# EasyEDA schematic Aquarium.Temperatur.json
TITLE: Aquarium.Temperatur; REV: 1.0; Date: 2019-01-31; Sheet: 1/1; Drawn By: Stefan Burkhardt; Company: Private
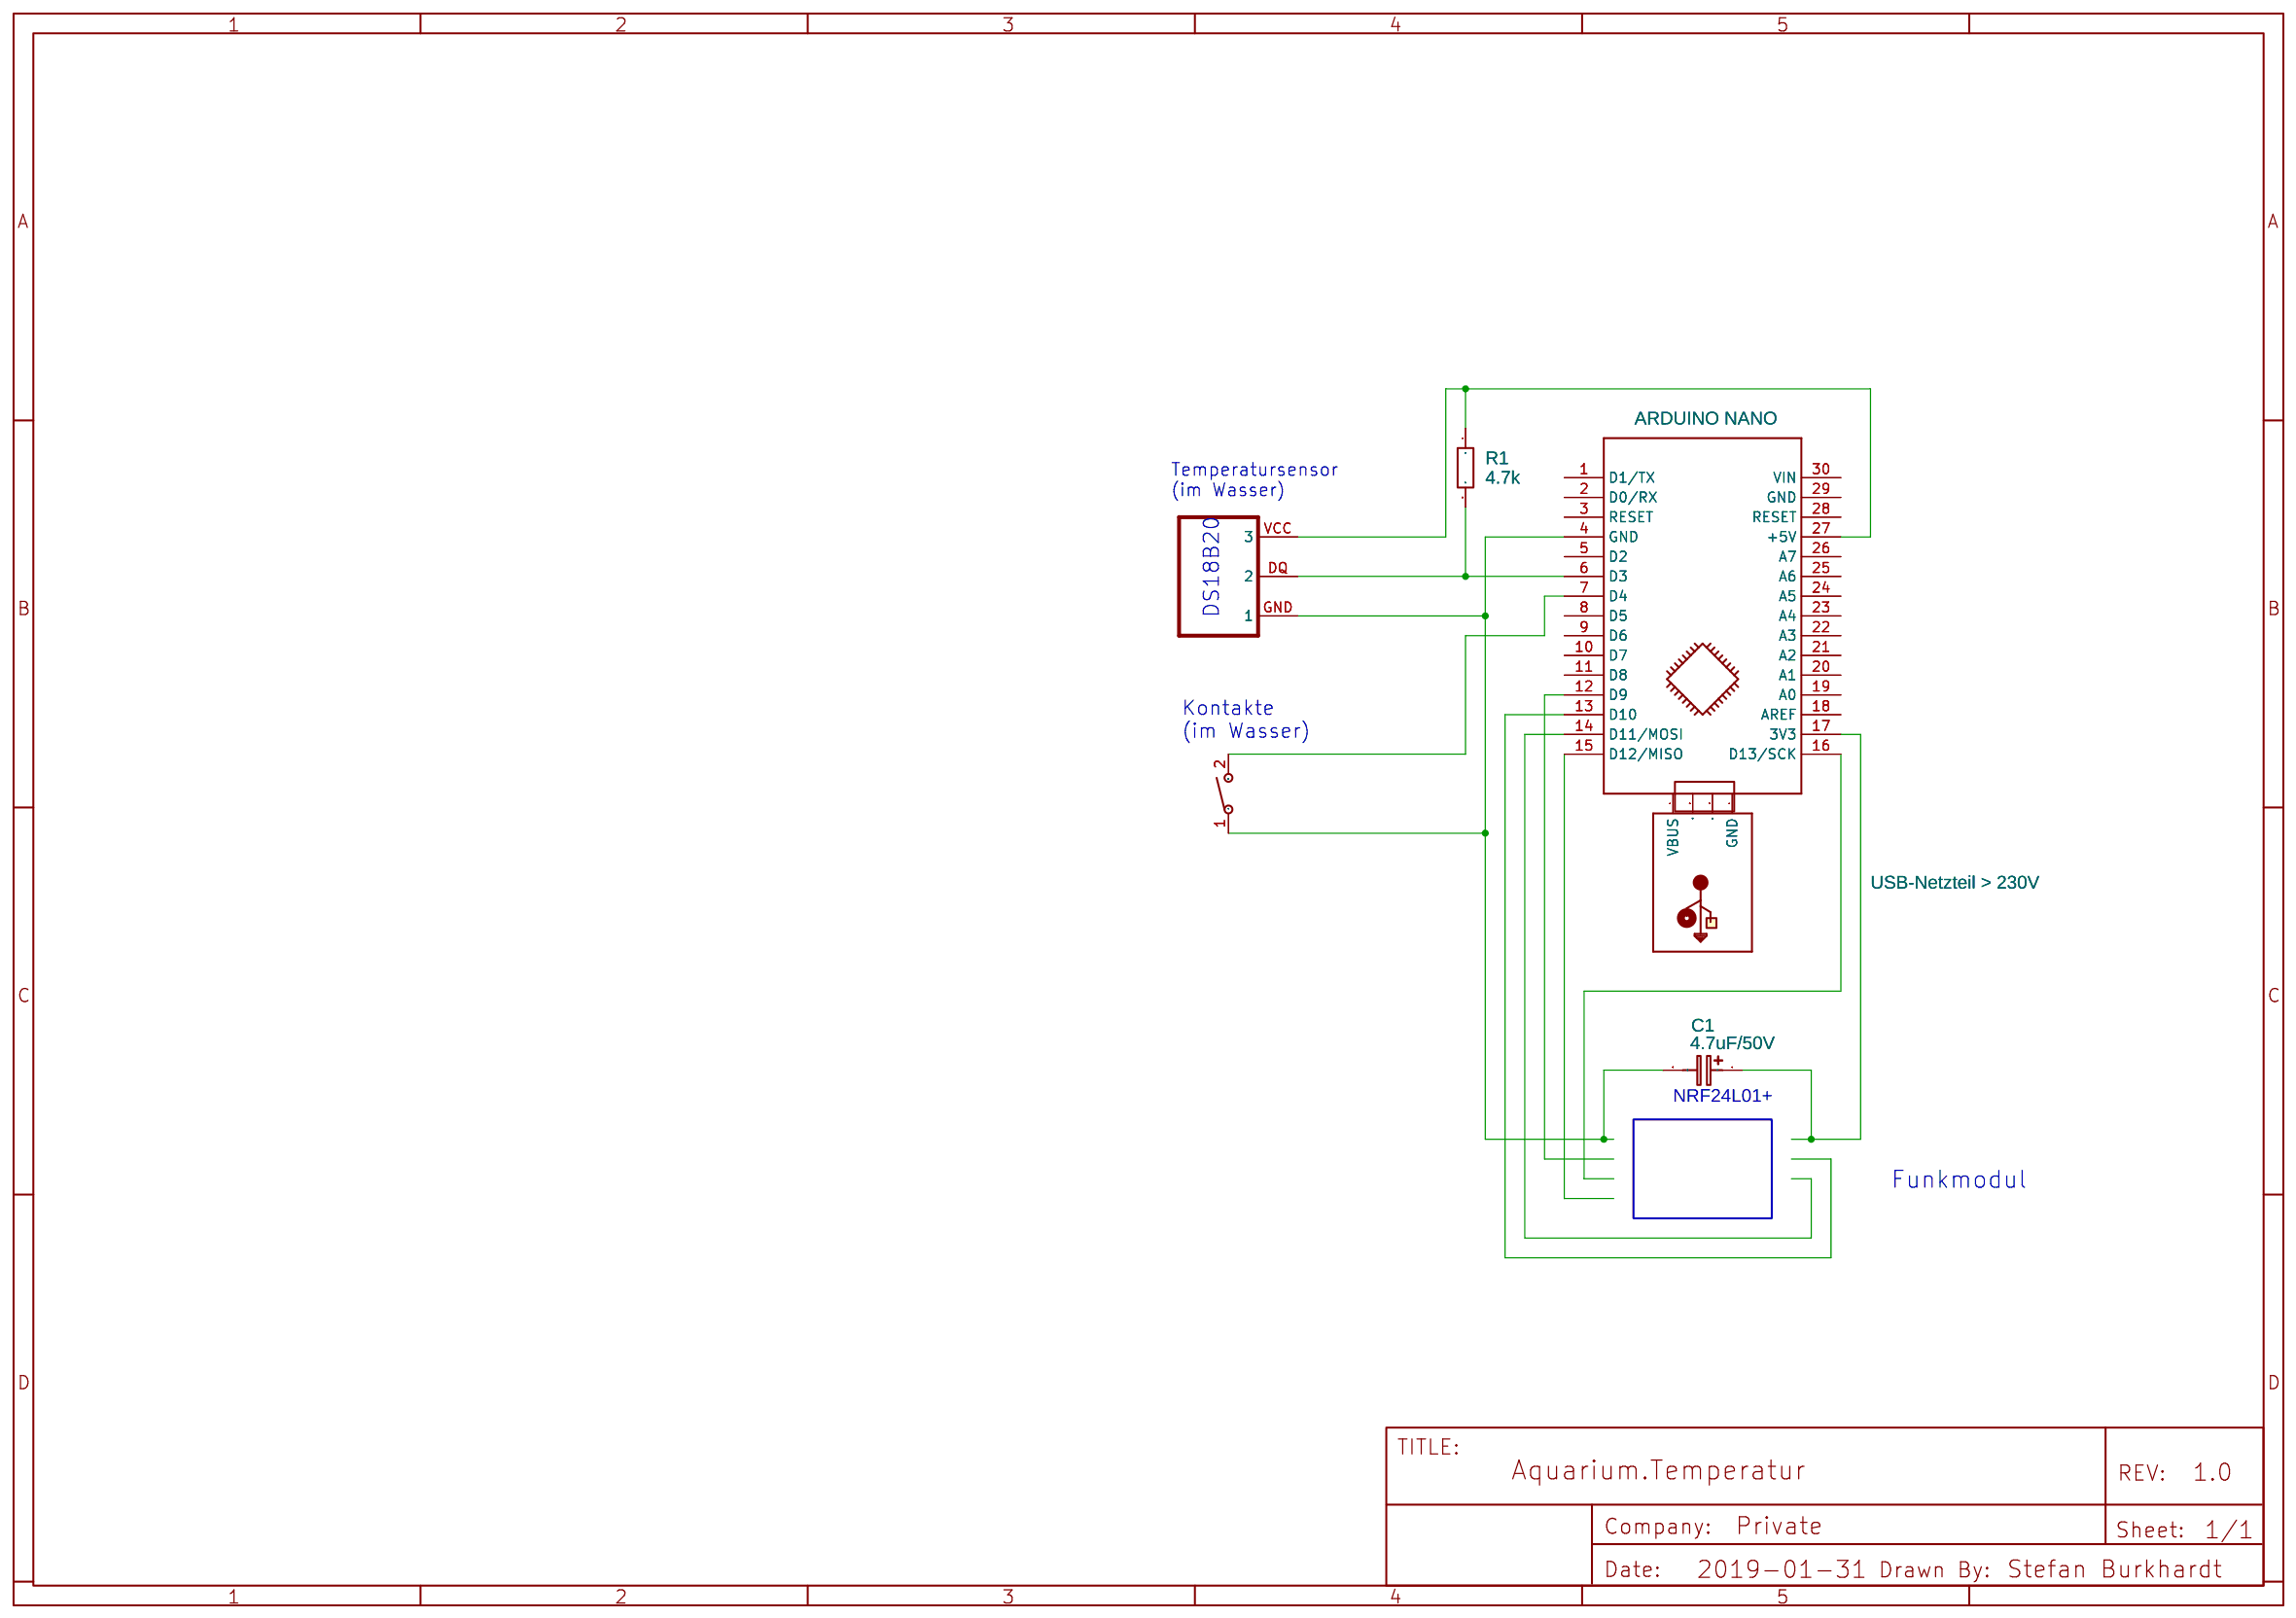
[diagram p0: schematic sheet]

## Parts
C1  4.7uF/50V  [CAP-D3.0XF1.5]
R1  4.7k  [AXIAL-0.3]
SW1  Wasser-Kurzschluss  [K2-1107ST-A4SW-06]
U1  ARDUINO NANO  [ARDUINO_NANO]
U2  DS18B20  [DIP]
X1  USB-Netzteil > 230V  [MOLEX_480371000]

## Library data of the parts
C1 = Cap_Electrolytic(TH)_D3.0XF1.5_EU: Contributor: EasyEDA; Manufacturer Part: ?
R1 = Res_AXIAL-0.3(1/8W)_EU: Manufacturer Part: ?
SW1 = -: Supplier: LCSC; Supplier Part: C118141; Manufacturer: Rectangular Connectors - Contacts; Contributor: LCSC
U1 = -: sourceId: KGSeAWhDB; Manufacturer Part: ?
U2 = -: Contributor: HGY; Manufacturer Part: ?
X1 = -: Contributor: Adafruit; Manufacturer Part: ?

## Nets
Net-(C1-1): C1.1 U1.17(3V3)
Net-(C1-2): C1.2 SW1.1 U1.4(GND) U2.GND(1)
Net-(R1-1): R1.1 U1.27(+5V) U2.VCC(3)
Net-(R1-2): R1.2 U1.6(D3) U2.DQ(2)
Net-(SW1-2): SW1.2 U1.7(D4)

Not connected (* = marked no-connect by the designer): U1 1(D1/TX) 2(D0/RX) 3(RESET) 5(D2) 8(D5) 9(D6) 10(D7) 11(D8) 12(D9) 13(D10) 14(D11/MOSI) 15(D12/MISO) 16(D13/SCK) 18(AREF) 19(A0) 20(A1) 21(A2) 22(A3) 23(A4) 24(A5) 25(A6) 26(A7) 28(RESET) 29(GND) 30(VIN); X1 1(VBUS) 2(D-) 3(D+) 4(GND)

## Notes on the sheet
- Temperatursensor
  (im Wasser)
- DS18B20
- Kontakte
  (im Wasser)
- NRF24L01+
- Funkmodul
